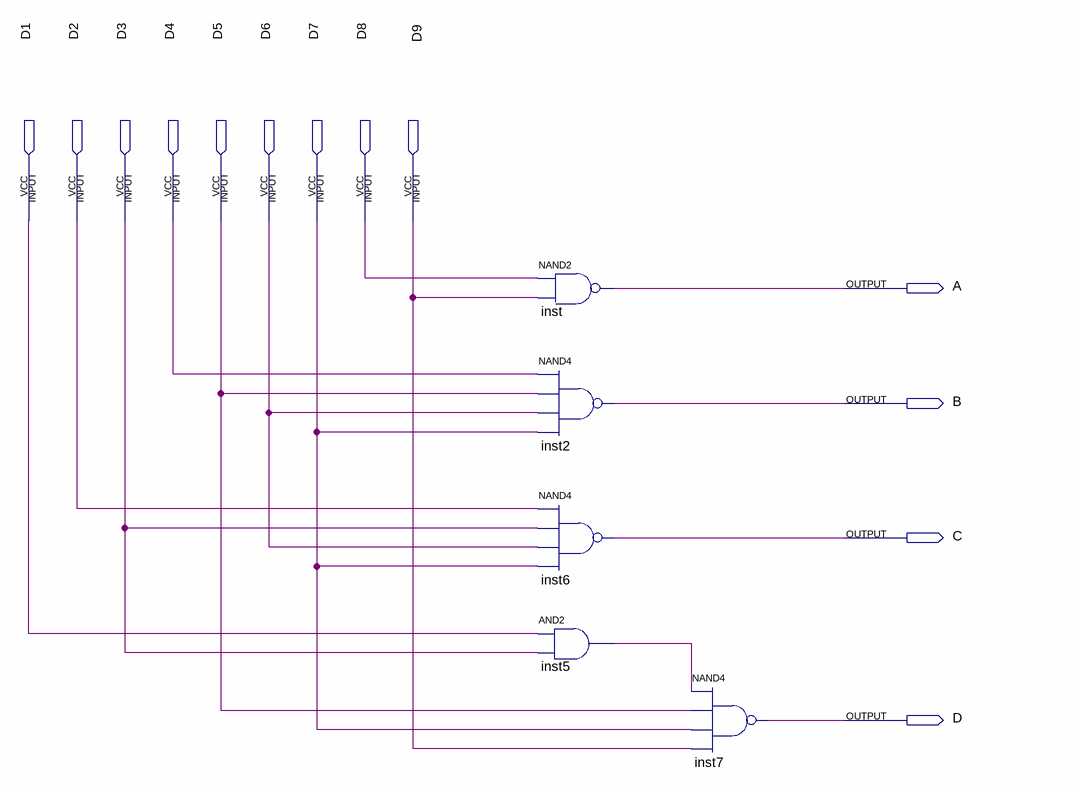
[diagram p0: schematic sheet]
// Quartus schematic DecBinDec.bdf as structural Verilog: 5 symbols, 13 pins
module DecBinDec (
  input  D1,
  input  D2,
  input  D3,
  input  D4,
  input  D5,
  input  D6,
  input  D7,
  input  D8,
  input  D9,
  output A,
  output B,
  output C,
  output D
);

  wire inst5_out;

  nand inst (A, D8, D9);
  nand inst2 (B, D4, D5, D6, D7);
  nand inst6 (C, D2, D3, D6, D7);
  and inst5 (inst5_out, D1, D3);
  nand inst7 (D, inst5_out, D5, D7, D9);
endmodule
